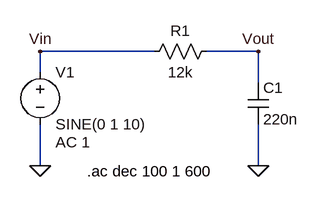
[diagram p0: schematic SubBassFilter1stOrder.asc]
SubBassFilter1stOrder.asc, the LTspice schematic file:
Version 4
SHEET 1 880 680
WIRE 96 96 -80 96
WIRE 256 96 176 96
WIRE -80 128 -80 96
WIRE 256 144 256 96
WIRE -80 272 -80 208
WIRE 256 272 256 208
FLAG -80 272 0
FLAG 256 272 0
FLAG -80 96 Vin
FLAG 256 96 Vout
SYMBOL res 192 80 R90
WINDOW 0 0 56 VBottom 2
WINDOW 3 32 56 VTop 2
SYMATTR InstName R1
SYMATTR Value 12k
SYMBOL cap 240 144 R0
SYMATTR InstName C1
SYMATTR Value 220n
SYMBOL voltage -80 112 R0
WINDOW 123 24 124 Left 2
WINDOW 39 0 0 Left 0
SYMATTR InstName V1
SYMATTR Value SINE(0 1 10)
SYMATTR Value2 AC 1
TEXT -8 280 Left 2 !.ac dec 100 1 600

The netlist it stands for:
* SubBassFilter1stOrder.asc
R1 Vout Vin 12k
C1 Vout 0 220n
V1 Vin 0 SINE(0 1 10) AC 1
.ac dec 100 1 600
.backanno
.end